# Altium schematic sheet right sub.schdoc
size 393 x 200 mm
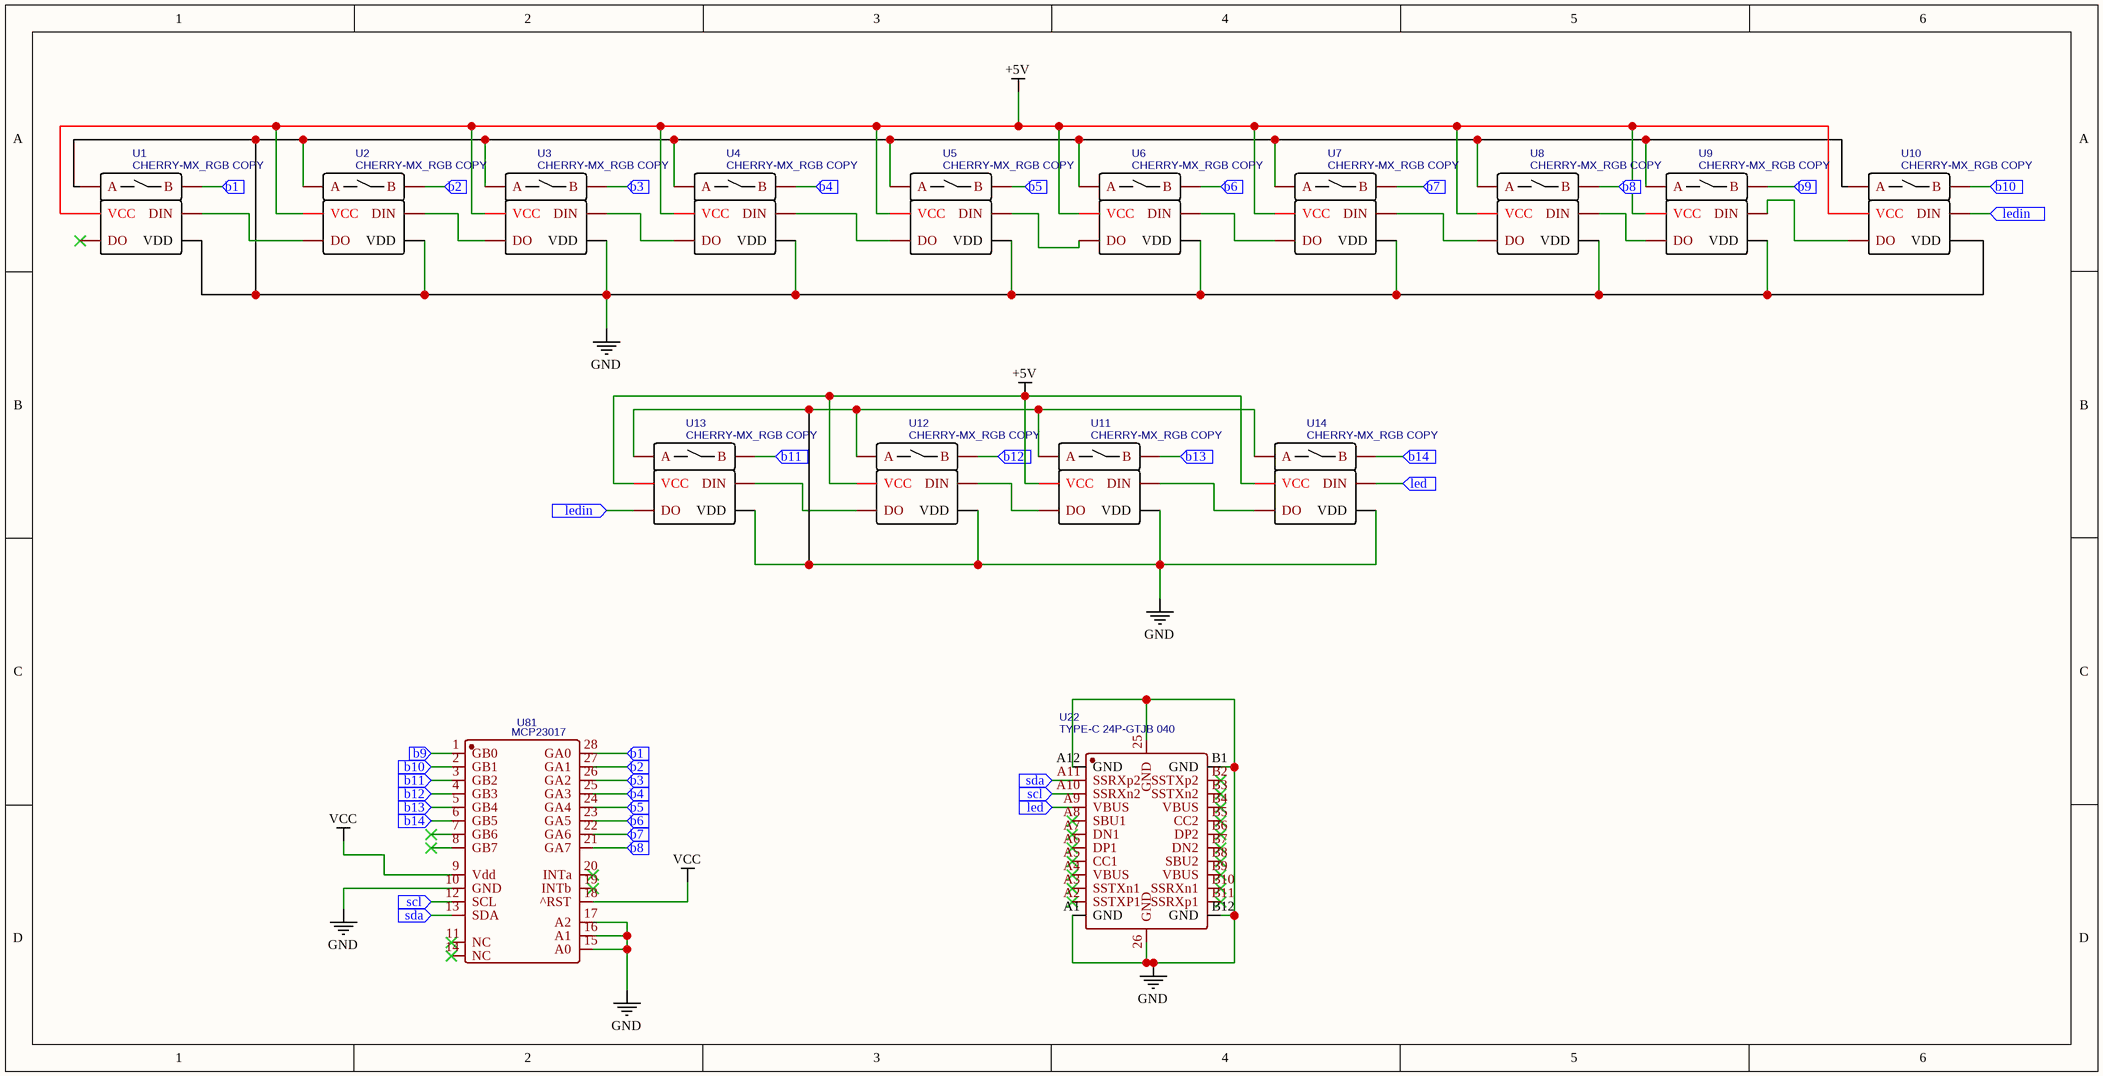
[diagram p0: right sub.schdoc]

## Parts
U1  CHERRY-MX_RGB COPY  [CHERRY-MX-RGB]
U2  CHERRY-MX_RGB COPY  [CHERRY-MX-RGB]
U3  CHERRY-MX_RGB COPY  [CHERRY-MX-RGB]
U4  CHERRY-MX_RGB COPY  [CHERRY-MX-RGB]
U5  CHERRY-MX_RGB COPY  [CHERRY-MX-RGB]
U6  CHERRY-MX_RGB COPY  [CHERRY-MX-RGB]
U7  CHERRY-MX_RGB COPY  [CHERRY-MX-RGB]
U8  CHERRY-MX_RGB COPY  [CHERRY-MX-RGB]
U9  CHERRY-MX_RGB COPY  [CHERRY-MX-RGB]
U10  CHERRY-MX_RGB COPY  [CHERRY-MX-RGB]
U11  CHERRY-MX_RGB COPY  [CHERRY-MX-RGB]
U12  CHERRY-MX_RGB COPY  [CHERRY-MX-RGB]
U13  CHERRY-MX_RGB COPY  [CHERRY-MX-RGB]
U14  CHERRY-MX_RGB COPY  [CHERRY-MX-RGB]
U22  TYPE-C 24P-GTJB 040  [USB-C-SMD_TYPE-C-24P-GTJB-040]
U81  MCP23017  [DIP-28_300MIL]

## Ports
b1 (in), b2 (in), b3 (in), b4 (in), b5 (in), b6 (in), b7 (in), b8 (in), b9 (in), b10 (in), b11 (in), b12 (in), b13 (in), b14 (in), led (in), ledin (in), scl (in), sda (in)

## Nets
+5V: U1.3(VCC) U2.3(VCC) U3.3(VCC) U4.3(VCC) U5.3(VCC) U6.3(VCC) U7.3(VCC) U8.3(VCC) U9.3(VCC) U10.3(VCC) U11.3(VCC) U12.3(VCC) U13.3(VCC) U14.3(VCC)
GND: U1.1(A) U1.5(VDD) U2.1(A) U2.5(VDD) U3.1(A) U3.5(VDD) U4.1(A) U4.5(VDD) U5.1(A) U5.5(VDD) U6.1(A) U6.5(VDD) U7.1(A) U7.5(VDD) U8.1(A) U8.5(VDD) U9.1(A) U9.5(VDD) U10.1(A) U10.5(VDD) U11.1(A) U11.5(VDD) U12.1(A) U12.5(VDD) U13.1(A) U13.5(VDD) U14.1(A) U14.5(VDD) U22.25(GND) U22.26(GND) U22.A1(GND) U22.A12(GND) U22.B1(GND) U22.B12(GND) U81.10(GND) U81.15(A0) U81.16(A1) U81.17(A2)
VCC: U81.9(Vdd) U81.18(^RST)
b1: U1.2(B) U81.28(GA0) ; port b1
b2: U2.2(B) U81.27(GA1) ; port b2
b3: U3.2(B) U81.26(GA2) ; port b3
b4: U4.2(B) U81.25(GA3) ; port b4
b5: U5.2(B) U81.24(GA4) ; port b5
b6: U6.2(B) U81.23(GA5) ; port b6
b7: U7.2(B) U81.22(GA6) ; port b7
b8: U8.2(B) U81.21(GA7) ; port b8
b9: U9.2(B) U81.1(GB0) ; port b9
b10: U10.2(B) U81.2(GB1) ; port b10
b11: U13.2(B) U81.3(GB2) ; port b11
b12: U12.2(B) U81.4(GB3) ; port b12
b13: U11.2(B) U81.5(GB4) ; port b13
b14: U14.2(B) U81.6(GB5) ; port b14
led: U14.6(DIN) U22.A9(VBUS) ; port led
ledin: U10.6(DIN) U13.4(DO) ; port ledin
scl: U22.A10(SSRXn2) U81.12(SCL) ; port scl
sda: U22.A11(SSRXp2) U81.13(SDA) ; port sda
NetU1_6: U1.6(DIN) U2.4(DO)
NetU2_6: U2.6(DIN) U3.4(DO)
NetU3_6: U3.6(DIN) U4.4(DO)
NetU4_6: U4.6(DIN) U5.4(DO)
NetU5_6: U5.6(DIN) U6.4(DO)
NetU6_6: U6.6(DIN) U7.4(DO)
NetU7_6: U7.6(DIN) U8.4(DO)
NetU8_6: U8.6(DIN) U9.4(DO)
NetU9_6: U9.6(DIN) U10.4(DO)
NetU11_4: U11.4(DO) U12.6(DIN)
NetU11_6: U11.6(DIN) U14.4(DO)
NetU12_4: U12.4(DO) U13.6(DIN)

Not connected (* = marked no-connect by the designer): U1 4(DO)*; U22 A2(SSTXP1)* A3(SSTXn1)* A4(VBUS)* A5(CC1)* A6(DP1)* A7(DN1)* A8(SBU1)* B2(SSTXp2)* B3(SSTXn2)* B4(VBUS)* B5(CC2)* B6(DP2)* B7(DN2)* B8(SBU2)* B9(VBUS)* B10(SSRXn1)* B11(SSRXp1)*; U81 7(GB6)* 8(GB7)* 11(NC)* 14(NC)* 19(INTb)* 20(INTa)*

## Library data of the parts
U1-U14 = CHERRY-MX_RGB COPY: Contributor: unrealin01; spicePre: U; spiceSymbolName: CHERRY-MX_RGB COPY
U22 = TYPE-C 24P-GTJB 040: Manufacturer: SHOU HAN(首韩); Contributor: lcsc; Supplier: LCSC; Supplier Part: C3151751; Manufacturer Part: TYPE-C 24P-GTJB 040; JLCPCB Part Class: Extended Part; spicePre: U; spiceSymbolName: TYPE-C 24P-GTJB 040
U81 = MCP23017: nameAlias: Model; catid: 20; Contributor: tsvstar; spicePre: X; spiceSymbolName: MCP23017